# EAGLE design sensor_enco (EAGLE 9.6.2)
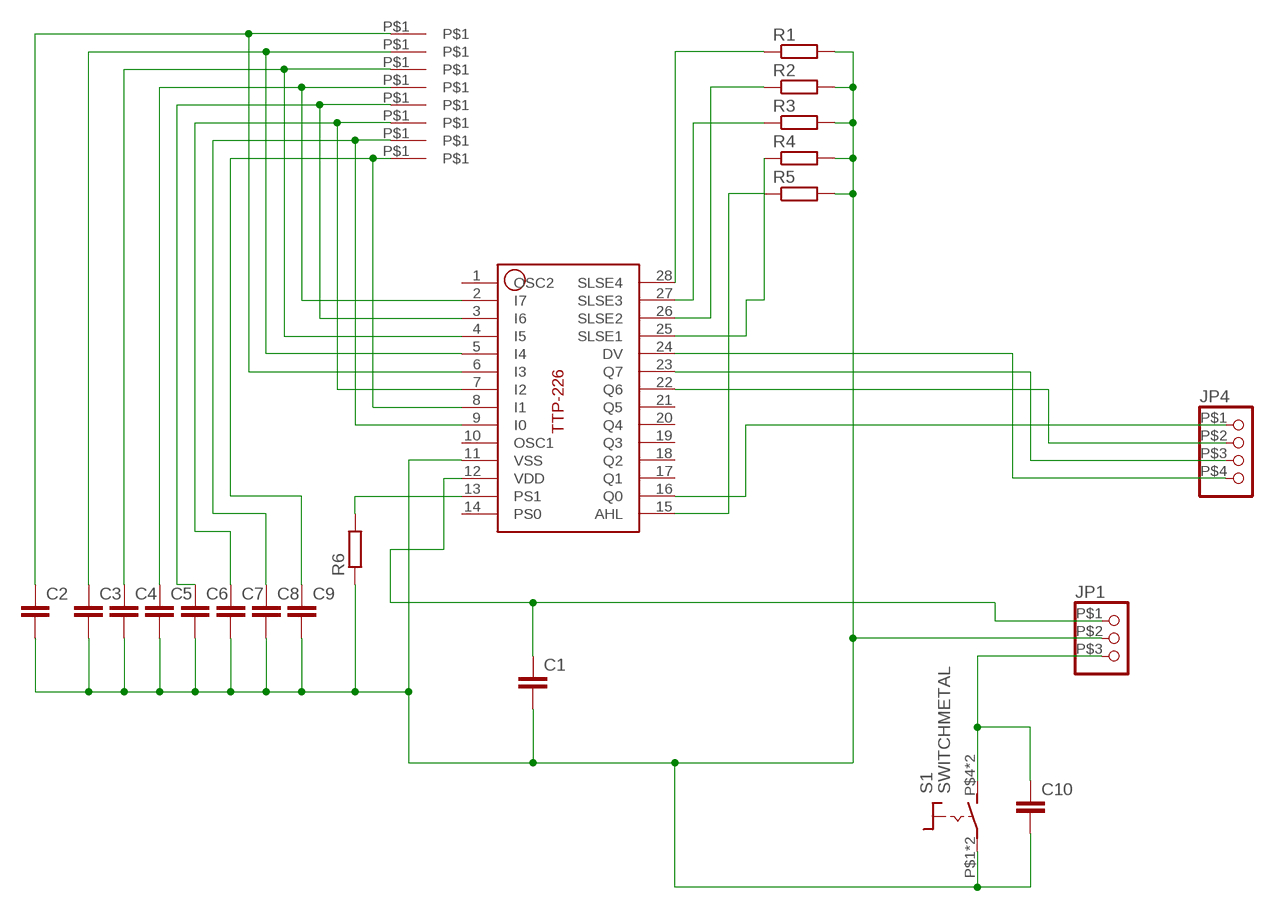
[diagram p0: schematic, sheet 1]

## Parts
C1  C-EUC0402  [C0402]
C2  C-EUC0402  [C0402]
C3  C-EUC0402  [C0402]
C4  C-EUC0402  [C0402]
C5  C-EUC0402  [C0402]
C6  C-EUC0402  [C0402]
C7  C-EUC0402  [C0402]
C8  C-EUC0402  [C0402]
C9  C-EUC0402  [C0402]
C10  C-EUC0402  [C0402]
JP1  PINHD-1X32MM  [1X03_2MM]
JP4  PINHD-1X42MM  [1X04_2MM]
R1  R-EU_R0402  [R0402]
R2  R-EU_R0402  [R0402]
R3  R-EU_R0402  [R0402]
R4  R-EU_R0402  [R0402]
R5  R-EU_R0402  [R0402]
R6  R-EU_R0402  [R0402]
S1  SWITCHMETAL  [SWMET]
U$1  SENSOR_PADSENSORPAD3  [SENSOR_PAD3]
U$2  SENSOR_PADSENSORPAD3  [SENSOR_PAD3]
U$9  TTP-226LIBTOUCH-TTP226  [TSSOP28]
U$10  SENSOR_PADSENSORPAD3  [SENSOR_PAD3]
U$11  SENSOR_PADSENSORPAD3  [SENSOR_PAD3]
U$12  SENSOR_PADSENSORPAD3  [SENSOR_PAD3]
U$13  SENSOR_PADSENSORPAD3  [SENSOR_PAD3]
U$14  SENSOR_PADSENSORPAD3  [SENSOR_PAD3]
U$15  SENSOR_PADSENSORPAD3  [SENSOR_PAD3]

## Nets
N$1: C3.1 U$2.P$1 U$9.5(I4)
N$2: C2.1 U$1.P$1 U$9.6(I3)
N$3: R3.1 U$9.27(SLSE3)
N$4: C9.1 U$9.8(I1) U$15.P$1
N$5: C7.1 U$9.7(I2) U$13.P$1
N$6: C4.1 U$9.4(I5) U$10.P$1
N$7: C5.1 U$9.2(I7) U$11.P$1
N$8: C8.1 U$9.9(I0) U$14.P$1
N$9: JP4.P$3 U$9.23(Q7)
N$10: JP4.P$4 U$9.24(DV)
N$11: JP4.P$2 U$9.22(Q6)
N$12: R1.1 U$9.28(SLSE4)
N$13: C1.2 C2.2 C3.2 C4.2 C5.2 C6.2 C7.2 C8.2 C9.2 C10.2 JP1.P$2 R1.2 R2.2 R3.2 R4.2 R5.2 R6.1 S1.P$1(P) S1.P$1@1(P) U$9.11(VSS)
N$14: C1.1 JP1.P$1 U$9.12(VDD)
N$15: R2.1 U$9.26(SLSE2)
N$16: R6.2 U$9.13(PS1)
N$17: JP4.P$1 U$9.16(Q0)
N$18: C10.1 JP1.P$3 S1.P$4(S) S1.P$4@1(S)
N$20: R5.1 U$9.15(AHL)
N$21: R4.1 U$9.25(SLSE1)
N$23: C6.1 U$9.3(I6) U$12.P$1
Unconnected: U$9.1(OSC2) U$9.10(OSC1) U$9.14(PS0) U$9.17(Q1) U$9.18(Q2) U$9.19(Q3) U$9.20(Q4) U$9.21(Q5)

## Library data of the parts
C1-C10 = rcl:C-EU: CAPACITOR, European symbol; SPICEPREFIX: C
JP1 = pinh2mm2:PINHD-1X3: PIN HEADER
JP4 = pinh2mm2:PINHD-1X4: PIN HEADER
R1-R6 = rcl:R-EU_: RESISTOR, European symbol; SPICEPREFIX: R
S1 = switchmetal:SWITCHMETAL
U$1 U$2 U$10-U$15 = sensor pad:SENSOR_PAD
U$9 = ttp226:TTP-226LIB: This is the eagle library for 8 channel touch ttp226-809SN ic. Author: Sumeri Lal Email: sumerilal1997.lko@gmail.com Source: github.com/SumeriLal/EagleCAD

## Board
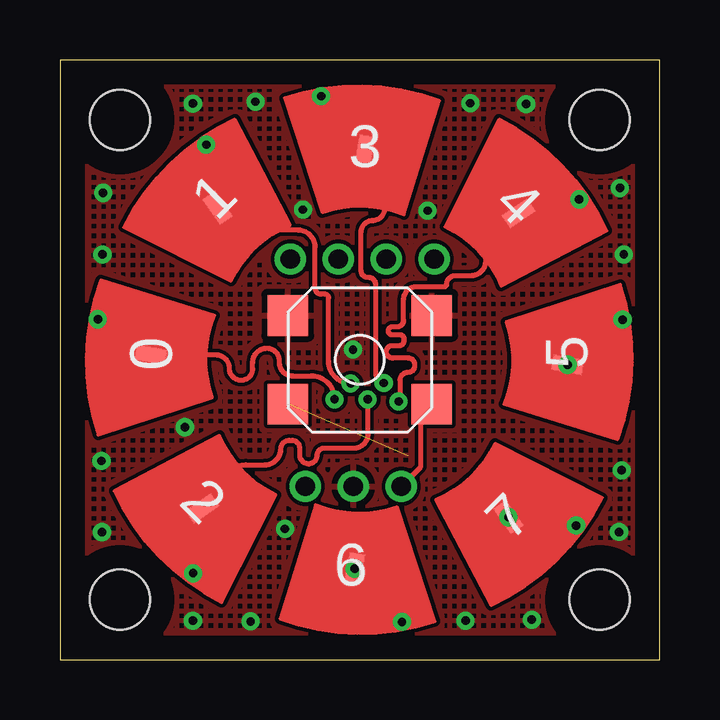
[diagram p1: board, top side]
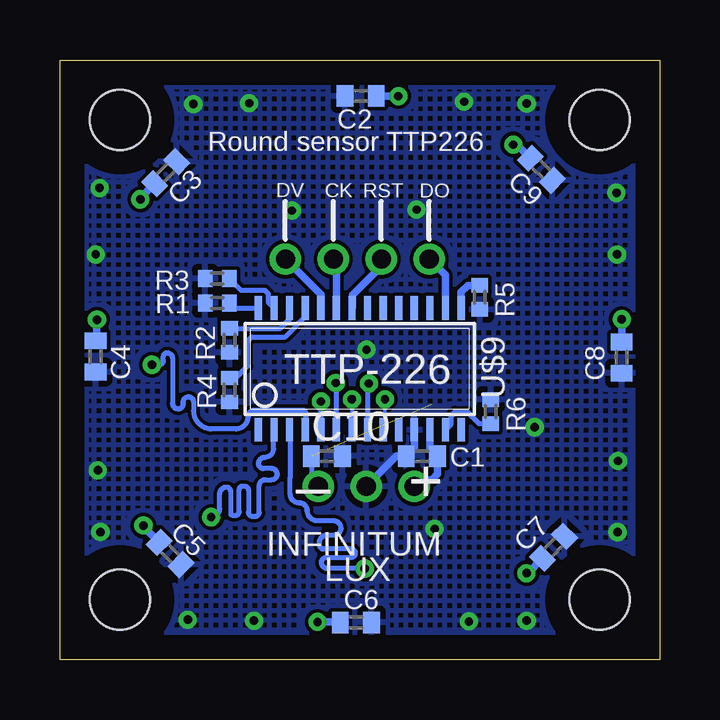
[diagram p2: board, bottom side, seen from below]

Size 25 x 25 mm. Coordinates in mm from the lower left corner, seen from the top.
Outline: 0,0 25,0 25,25 0,25 0,0
Copper layers (1*16): Top 0.035mm / dielectric 1.5mm / Bottom 0.035mm
Design rules "default *": minimum track width 6mil, minimum drill 0.35mm, track to track 6mil, track to pad 6mil, pad to pad 6mil, via to via 6mil, smd to smd 6mil, copper to edge 40mil, drill to drill 6mil, minimum pad ring 10mil, minimum via ring 8mil, stop-mask expansion 4mil, vias tented up to drill 14mil, thermal gap 10mil
Holes 2.5 mm at 2.5,22.5 22.5,22.5 22.5,2.5 2.5,2.5

### Footprints (pad centres in the part's own frame; a part is rotated, then mirrored left to right if it is on the bottom)
C0402 = smd 0.7 x 0.9: 1 -0.65,0; 2 0.65,0
1X03_2MM = drill 0.8: P$1 -2,0; P$2 0,0; P$3 2,0
1X04_2MM = drill 0.8: P$1 -4,0; P$2 -2,0; P$3 0,0; P$4 2,0
R0402 = smd 0.6 x 0.7: 1 -0.5,0; 2 0.5,0
SWMET = smd 1.7 x 1.7: P$1 -3,1.85; P$1@1 3,1.85; P$4 -3,-1.85; P$4@1 3,-1.85
SENSOR_PAD3 = smd 1.27 x 0.635 rotated 79.5: P$1 0.208,-0.094
TSSOP28 = smd 0.305 x 0.991: 1 -4.225,-2.918; 2 -3.575,-2.918; 3 -2.925,-2.918; 4 -2.275,-2.918; 5 -1.625,-2.918; 6 -0.975,-2.918; 7 -0.325,-2.918; 8 0.325,-2.918; 9 0.975,-2.918; 10 1.625,-2.918; 11 2.275,-2.918; 12 2.925,-2.918; 13 3.575,-2.918; 14 4.225,-2.918; 15 4.225,2.156; 16 3.575,2.156; 17 2.925,2.156; 18 2.275,2.156; 19 1.625,2.156; 20 0.975,2.156; 21 0.325,2.156; 22 -0.325,2.156; 23 -0.975,2.156; 24 -1.625,2.156; 25 -2.275,2.156; 26 -2.925,2.156; 27 -3.575,2.156; 28 -4.225,2.156

### Placement (x,y rotation side)
C1  9.91,8.48 180 bottom
C2  12.46,23.5 180 bottom
C3  20.59,20.3 45 bottom
C4  23.51,12.64 270 bottom
C5  20.41,4.42 315 bottom
C6  12.66,1.55 0 bottom
C7  4.42,4.68 45 bottom
C8  1.58,12.59 270 bottom
C9  4.93,20.44 315 bottom
C10  13.87,8.48 0 bottom
JP1  12.23,7.22 0 top
JP4  13.6,16.7 0 top
R1  18.44,14.86 180 bottom
R2  17.93,13.31 270 bottom
R3  18.44,15.89 180 bottom
R4  17.93,11.24 270 bottom
R5  7.5,15.1 270 bottom
R6  7.04,10.34 270 bottom
S1  12.5,12.5 0 top
U$1  12.5,21.3 0 top
U$2  19.04,18.82 315 top
U$9  12.5,12.5 0 bottom
U$10  21.26,12.5 270 top
U$11  18.91,6.02 225 top
U$12  12.5,3.7 180 top
U$13  6.02,6.09 135 top
U$14  3.7,12.5 90 top
U$15  6.36,18.76 45 top

### Tracks (layer width: path | path; a pad name or v marks a point on that pad's centre or on a via)
N$1  (via drill 0.35)
  Top 0.2: v14.12,10.76 14.18,10.82 14.18,11.64 arc-90 14.52,11.98 arc90 14.8,12.26 14.8,12.29 arc90 14.52,12.57 13.87,12.57 arc-90 13.61,12.83 13.61,12.84 arc-90 13.86,13.09 14.14,13.09 arc90 14.35,13.3 14.35,13.36 arc90 14.17,13.54 13.85,13.54 arc-90 13.69,13.7 arc-90 13.87,13.88 14.07,13.88 arc90 14.33,14.14 14.33,15.02 arc-90 14.86,15.55 16.06,15.55 16.12,15.61 arc90 16.12,15.64 arc-90 16.49,16.01 17.14,16.01 arc90 17.76,16.63 17.76,17.25 arc-90 U$2.P$1 21.07,18.61 v21.65,19.19
  Bottom 0.2: v14.12,10.76 v14.13,10.75 U$9.5
  Bottom 0.305: C3.1 21.65,19.24 v21.65,19.19
N$2  (via drill 0.35)
  Top 0.2: v13.5,11.53 13.17,11.86 13.17,15.63 arc90 12.87,15.93 12.83,15.93 arc-90 12.56,16.2 12.56,17.83 arc-90 13.04,18.31 arc90 13.54,18.81 13.54,20.37 arc90 U$1.P$1 12.71,21.67 v10.89,23.49
  Bottom 0.2: v13.5,11.53 13.49,11.53 13.49,9.6 U$9.6
  Bottom 0.305: C2.1 v10.89,23.49
N$3
  Bottom 0.2: R3.1 17.45,15.4 16.47,15.4 16.32,15.26 16.32,14.9 U$9.27
N$4  (via drill 0.35)
  Top 0.2: v12.12,11.51 arc-90 11.2,12.43 11.2,15.08 arc90 11.05,15.23 10.9,15.23 arc-90 10.64,15.49 10.64,17.2 arc90 9.94,17.9 7.51,17.9 arc-90 U$15.P$1 6.57,20.94 6.1,21.41 v6.1,21.47
  Bottom 0.2: v12.12,11.51 v12.11,11.5 12.18,11.44 U$9.8
  Bottom 0.305: C9.1 5.93,21.44 6.13,21.44 v6.1,21.47
N$5  (via drill 0.35)
  Top 0.2: v12.83,10.85 arc-90 12.85,10.83 12.85,9.41 arc-90 12.26,8.82 11.03,8.82 arc90 10.72,8.51 10.72,8.52 arc-90 10.37,8.16 arc-90 9.99,8.54 9.99,8.84 arc90 9.69,9.14 9.57,9.14 arc90 9.21,8.78 arc-90 8.55,8.12 7.75,8.12 arc90 U$13.P$1 5.55,5.92 v5.55,3.6
  Bottom 0.152: v12.83,10.85 U$9.7
  Bottom 0.305: C7.1 5.5,3.6 v5.55,3.6
N$6  (via drill 0.35)
  Top 0.2: v23.46,14.17 21.58,12.29 U$10.P$1
  Bottom 0.2: U$9.4 arc90 14.79,9.6 arc-90 14.78,9.61 arc-90 14.76,9.63 14.76,10.27 arc-90 14.89,10.4 16.89,10.4 arc-90 17.15,10.14 arc90 17.67,9.62 18.68,9.62 arc90 19.43,10.37 19.43,10.75 arc-90 19.64,10.96 arc-90 19.86,10.73 19.86,10.66 arc90 20.07,10.45 arc90 20.31,10.69 20.31,12.57 arc-90 20.53,12.79 arc-90 20.69,12.63 20.69,12.47 arc90 20.87,12.29 U$10.P$1
  Bottom 0.305: C4.1 23.46,13.34 v23.46,14.17
  other vias: 21.17,12.29
N$7  (via drill 0.35)
  Top 0.2: U$11.P$1 21.17,5.94 v21.52,5.59
  Bottom 0.2: U$11.P$1 arc-90 18.34,6.29 18.34,6.91 arc90 18.06,7.19 arc90 17.89,7.01 17.89,6.11 arc-90 17.79,6.01 17.69,6.01 arc-90 17.53,6.17 17.53,7.08 arc90 17.38,7.23 17.31,7.23 arc90 17.14,7.06 17.14,6.14 arc-90 16.97,5.97 16.87,5.97 arc-90 16.69,6.15 16.69,7.24 arc90 16.43,7.5 16.17,7.5 arc-90 15.94,7.73 arc-90 16.18,7.96 16.52,7.96 arc90 16.72,8.17 arc90 16.45,8.44 arc-90 16.09,8.8 16.09,9.54 16.06,9.57 arc-90 U$9.2
  Bottom 0.305: C5.1 21.52,5.53 v21.52,5.59
  other vias: 18.7,5.94
N$8  (via drill 0.35)
  Top 0.2: v11.45,10.85 arc90 10.47,11.83 9.7,11.83 arc-90 9.14,12.39 9.14,12.47 arc90 8.63,12.98 arc90 8.04,12.38 8.04,12.12 arc-90 7.55,11.64 arc-90 7.06,12.14 arc90 6.49,12.71 U$14.P$1 2.31,14.19 v1.58,14.19
  Bottom 0.152: v11.45,10.85 11.45,9.66 U$9.9
  Bottom 0.305: C8.1 v1.58,14.19
N$9
  Bottom 0.305: U$9.23 13.47,16.57 JP4.P$3
N$10
  Bottom 0.305: U$9.24 14.12,15.22 JP4.P$4
N$11
  Bottom 0.305: U$9.22 12.8,14.68 12.8,15.2 11.6,16.4 JP4.P$2
N$12
  Bottom 0.2: R1.1 17.74,14.66 U$9.28
N$13  (via drill 0.35)
  Bottom 0.305: U$9.11 10.22,8.81 C1.2 10.97,8.48 JP1.P$2
  other vias: 10.13,18.76 15.33,18.72 5.21,9.69 9.38,5.45 19.44,23.16 17.11,23.2 8.15,23.26 5.54,23.18 1.8,19.46 1.77,16.89 1.73,8.28 1.75,5.31 5.54,1.62 7.95,1.59 16.91,1.62 19.67,1.66 23.42,7.89 23.31,5.32 23.51,16.89 23.35,19.66 12.22,12.92
  pour Bottom (hatched): 0,25 0,0 25,0 25,25
  pour Top (hatched): -0.03,25.02 -0.03,-0.05 24.98,-0.05 25.03,0 25.03,24.96 25,24.99 0,24.99
N$14
  Bottom 0.305: U$9.12 9.57,8.79 C1.1 9.26,7.74 9.5,7.5 9.95,7.5 JP1.P$1
N$15
  Bottom 0.2: U$9.26 15.42,14.2 15.81,13.81 R2.1
N$16
  Bottom 0.2: U$9.13 8.68,9.83 8.68,10.18 8.53,10.33 8.02,10.33 7.53,9.84 R6.2
N$17
  Bottom 0.305: U$9.16 8.93,16.02 JP4.P$1
N$18  (1 unrouted)
  Top 0.2: JP1.P$3 15.05,8.04 15.05,10.2 S1.P$4@1
  Bottom 0.2: C10.1 14.51,7.5 JP1.P$3
N$20
  Bottom 0.305: R5.1 7.99,15.6 8.28,15.31 U$9.15
N$21
  Bottom 0.2: R4.1 17.67,11.74 17.19,12.22 17.19,13.27 17,13.46 15.6,13.46 14.76,14.3 14.76,14.64 U$9.25
N$23  (via drill 0.35)
  Top 0.2: U$12.P$1 12.29,3.54 v14.26,1.57
  Bottom 0.2: U$9.3 15.4,9.56 15.4,7.59 arc90 15.4,7.59 15.4,6.9 arc-90 15.03,6.53 15.01,6.53 arc90 14.69,6.21 arc-90 14.27,5.79 13.6,5.79 13.59,5.79 arc90 13.28,5.48 arc90 13.57,5.19 13.87,5.19 arc-90 14.18,4.88 14.18,4.78 arc-90 14.01,4.61 12.85,4.61 arc90 12.68,4.44 arc90 12.86,4.26 13.89,4.26 arc-90 14.1,4.05 arc-90 13.84,3.79 U$12.P$1
  Bottom 0.305: C6.1 13.33,1.57 v14.26,1.57
  other vias: 12.29,3.79

### Text on the board
bPlace: Round sensor TTP226 | LUX
tNames: 3 | 4 | 1 | 0 | 5 | 2 | 7 | 6
bNames: RST | DO | CK | DV | + | _ | INFINITUM